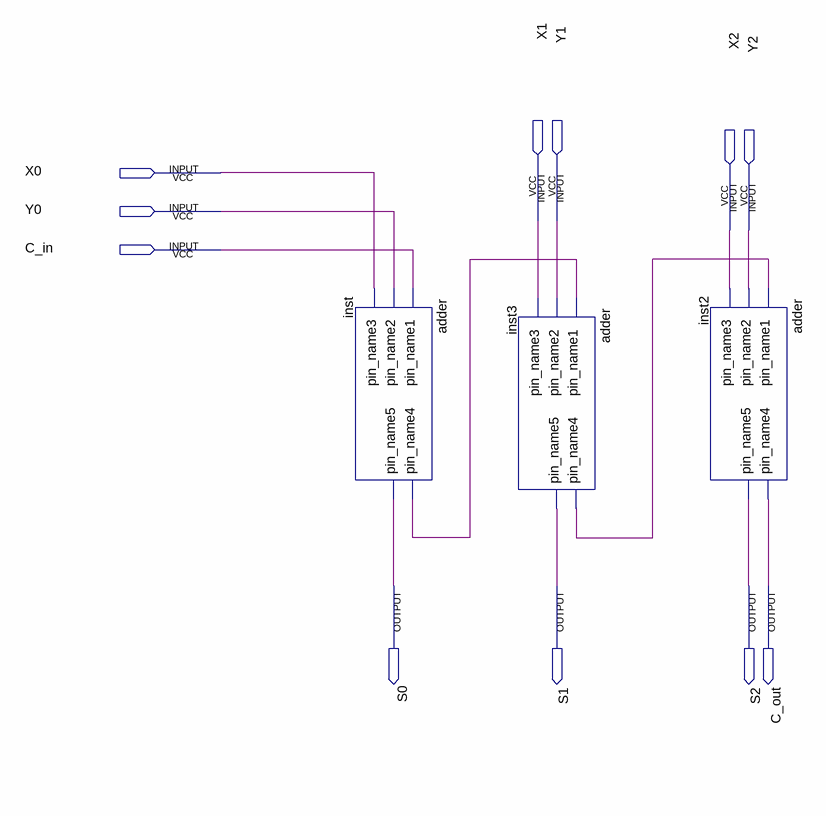
[diagram p0: schematic sheet]
// Quartus schematic 3bit_adder.bdf as structural Verilog: 3 symbols, 11 pins
module \3bit_adder  (
  input  X0,
  input  Y0,
  input  X1,
  input  Y1,
  input  X2,
  input  Y2,
  input  C_in,
  output S0,
  output S1,
  output S2,
  output C_out
);

  wire inst3_pin_name4, inst_pin_name4;

  adder inst (.pin_name1(C_in), .pin_name2(Y0), .pin_name3(X0), .pin_name4(inst_pin_name4), .pin_name5(S0));
  adder inst3 (.pin_name1(inst_pin_name4), .pin_name2(Y1), .pin_name3(X1), .pin_name4(inst3_pin_name4), .pin_name5(S1));
  adder inst2 (.pin_name1(inst3_pin_name4), .pin_name2(Y2), .pin_name3(X2), .pin_name4(C_out), .pin_name5(S2));
endmodule
